# EAGLE schematic miconborad (EAGLE 6.5.0)
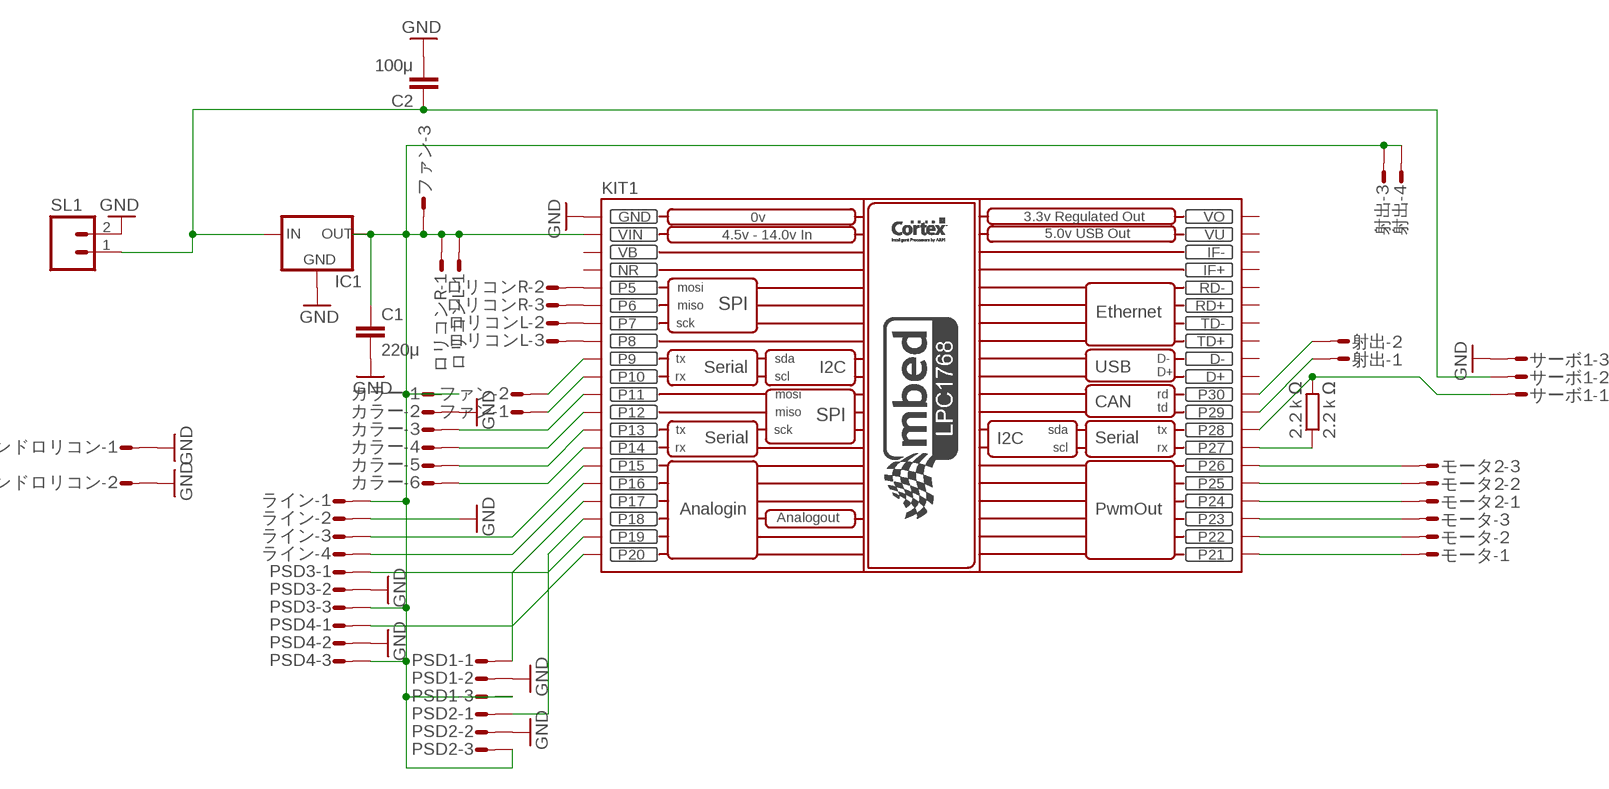
[diagram p0: schematic, sheet 1]

## Parts
2.2ｋΩ  2.2ｋΩ  R-EU_0204/2V  [0204V]
C1  220μ  C-EU025-024X044  [C025-024X044]
C2  100μ  C-EU025-024X044  [C025-024X044]
IC1  78XX_V  [78XXV]
KIT1  MBED_NXP_LPC1768  [MBED-KIT]
PSD1  S03P  [S03P]
PSD2  S03P  [S03P]
PSD3  S03P  [S03P]
PSD4  S03P  [S03P]
SL1  M02  [02P]
カラー  S06P  [S06P]
グランドロリコン  S02P  [S02P]
サーボ1  S03P  [S03P]
ファン  S03P  [S03P]
モータ  S03P  [S03P]
モータ2  S03P  [S03P]
ライン  S04P  [S04P]
ロリコンL  S03P  [S03P]
ロリコンR  S03P  [S03P]
射出  S04P  [S04P]

## Nets
GND: C1.2 C2.2 IC1.GND KIT1.P$1(GND) PSD1.2 PSD2.2 PSD3.2 PSD4.2 SL1.2 カラー.2 グランドロリコン.1 グランドロリコン.2 サーボ1.3 ライン.2
N$1: C2.1 IC1.IN SL1.1 サーボ1.2
N$2: 2.2ｋΩ.1 KIT1.P$27(P27)
N$3: KIT1.P$21(P21) モータ.1
N$4: KIT1.P$22(P22) モータ.2
N$5: KIT1.P$11(P11) カラー.3
N$6: KIT1.P$23(P23) モータ.3
N$7: KIT1.P$24(P24) モータ2.1
N$8: KIT1.P$25(P25) モータ2.2
N$9: KIT1.P$26(P26) モータ2.3
N$10: 2.2ｋΩ.2 KIT1.P$28(P28) サーボ1.1
N$11: KIT1.P$12(P12) カラー.4
N$12: KIT1.P$13(P13) カラー.5
N$13: KIT1.P$14(P14) カラー.6
N$14: KIT1.P$19(P19) PSD3.1
N$15: KIT1.P$15(P15) ライン.3
N$16: KIT1.P$18(P18) PSD2.1
N$17: KIT1.P$17(P17) PSD1.1
N$18: KIT1.P$16(P16) ライン.4
N$19: KIT1.P$20(P20) PSD4.1
N$20: KIT1.P$9(P9) ファン.2
N$21: KIT1.P$10(P10) ファン.1
N$22: KIT1.P$5(P5) ロリコンR.2
N$23: KIT1.P$29(P29) 射出.1
N$24: KIT1.P$6(P6) ロリコンR.3
N$25: C1.1 IC1.OUT KIT1.P$2(VIN) PSD1.3 PSD2.3 PSD3.3 PSD4.3 カラー.1 ファン.3 ライン.1 ロリコンL.1 ロリコンR.1 射出.3 射出.4
N$26: KIT1.P$7(P7) ロリコンL.2
N$27: KIT1.P$8(P8) ロリコンL.3
N$31: KIT1.P$30(P30) 射出.2
Unconnected: KIT1.P$31(D+) KIT1.P$32(D-) KIT1.P$33(TD+) KIT1.P$34(TD-) KIT1.P$35(RD+) KIT1.P$36(RD-) KIT1.P$37(IF+) KIT1.P$38(IF-)

## Power pins joined to a net without a drawn wire
NR: KIT1.P$4(NR)
VB: KIT1.P$3(VB)
VO: KIT1.P$40(VO)
VU: KIT1.P$39(VU)

## Library data of the parts
2.2ｋΩ = rcl:R-EU_: RESISTOR, European symbol
C1 C2 = rcl:C-EU: CAPACITOR, European symbol
IC1 = mbed-ics:78XX: VOLTAGE REGULATOR
KIT1 = MBED_v2.1:MBED_NXP_LPC1768: Mbed LPC1768 - ARM CORTEX v2.1 * Schematic symbol is now placed in eagles's default raster. *The pads diameter are suitable for routing between mbed pins * mbed pads are 0.8 mm drill diameter. --------------------------------------------- Created by: Mohamed Yousry *Alexandria, Egypt *Email: mohamed.yousry@ieeegoldegypt.org
PSD1-PSD4 サーボ1 ファン モータ モータ2 ロリコンL ロリコンR = con-amp-mt:S03P: AMP MT CONNECTOR; OC_FARNELL: unknown; OC_NEWARK: unknown
SL1 = con-amp-quick:M02: AMP QUICK CONNECTOR; OC_FARNELL: unknown; OC_NEWARK: unknown
カラー = con-amp-mt:S06P: AMP MT CONNECTOR; OC_FARNELL: unknown; OC_NEWARK: unknown
グランドロリコン = con-amp-mt:S02P: AMP MT CONNECTOR; OC_FARNELL: unknown; OC_NEWARK: unknown
ライン 射出 = con-amp-mt:S04P: AMP MT CONNECTOR; OC_FARNELL: unknown; OC_NEWARK: unknown